# EAGLE design bus (EAGLE 9.6.2)
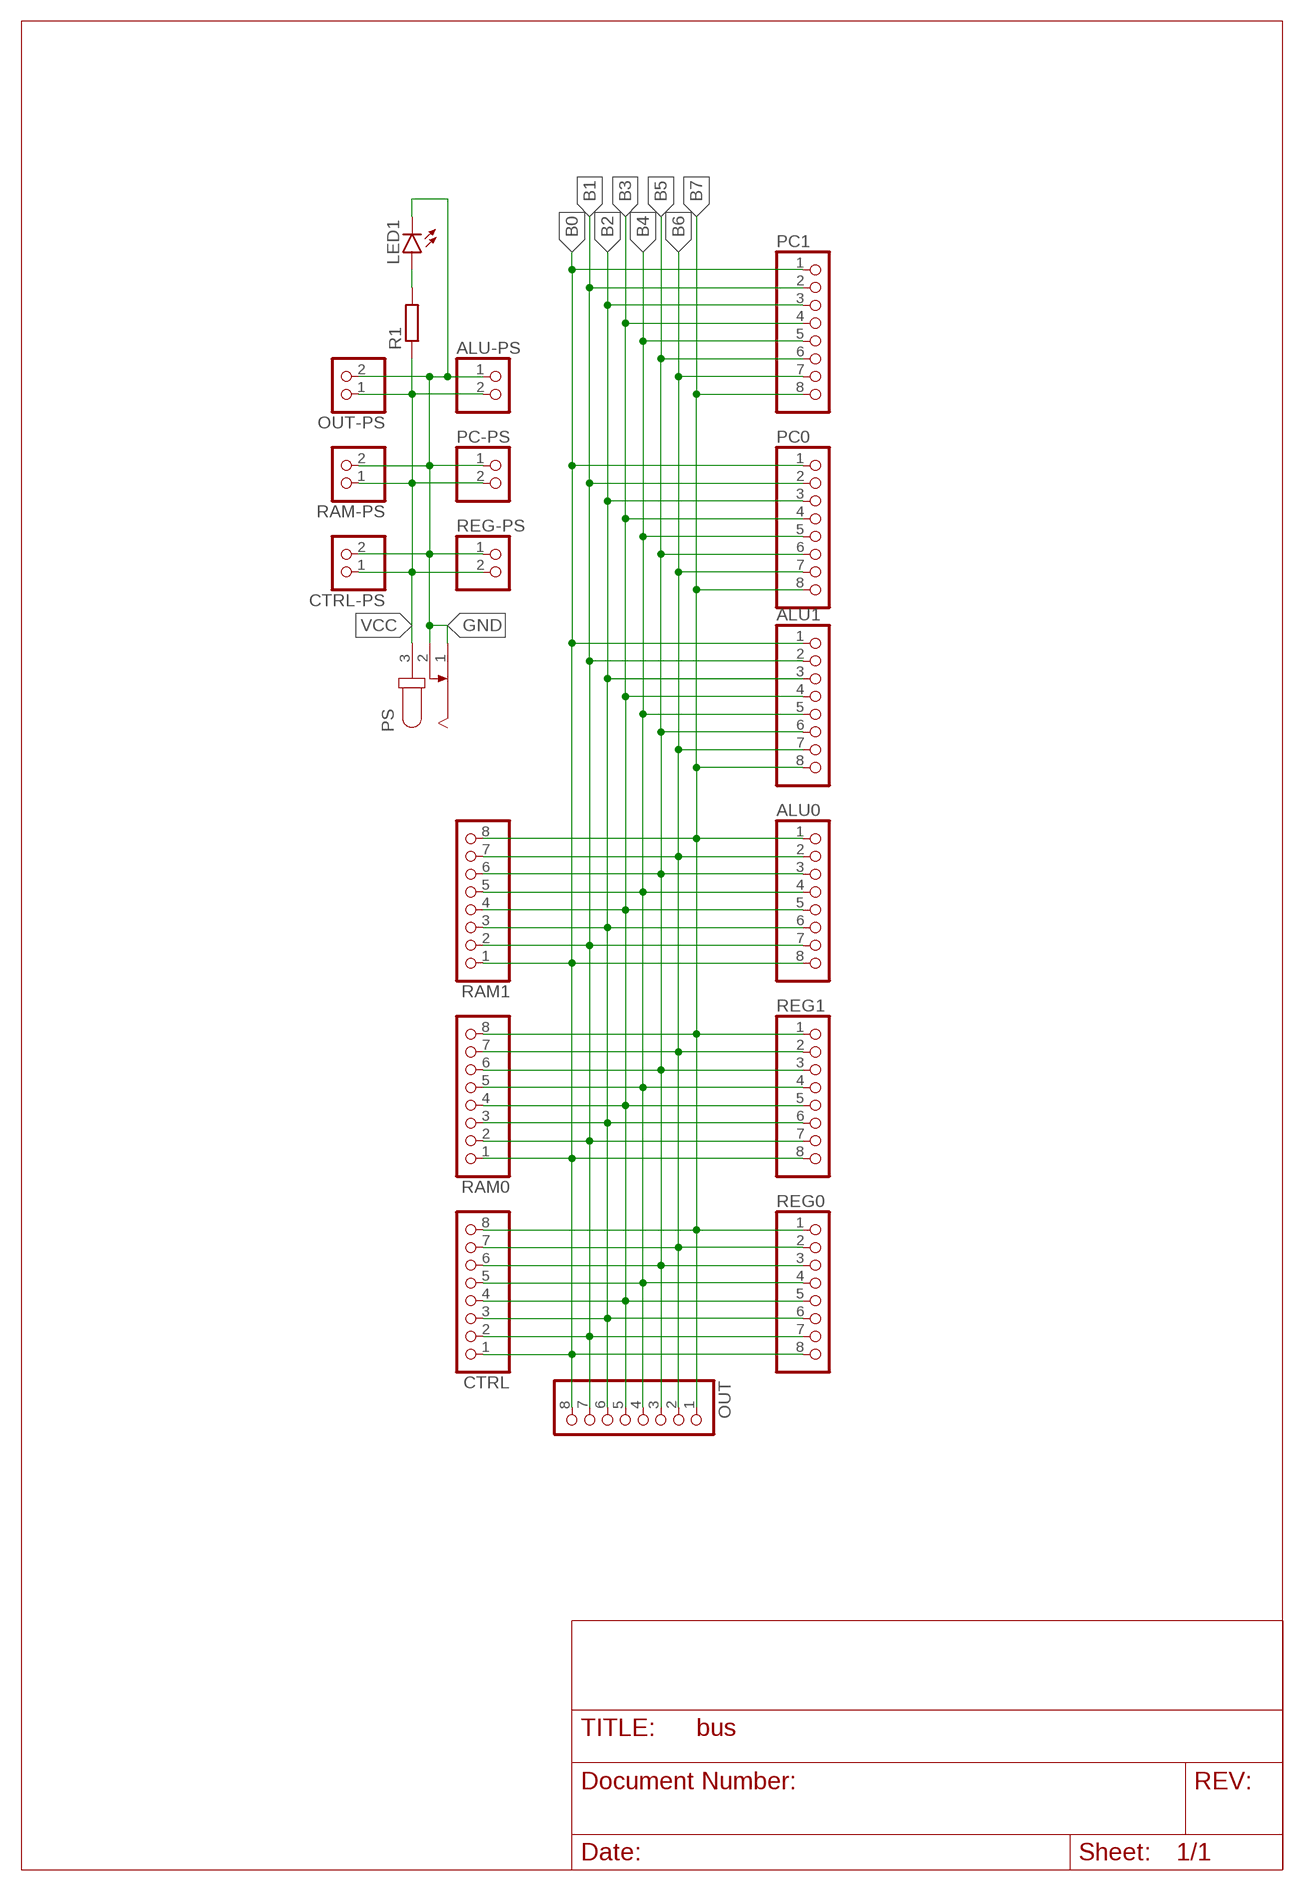
[diagram p0: schematic, sheet 1]

## Parts
ALU0  PINHD-1X8  [1X08]
ALU1  PINHD-1X8  [1X08]
ALU-PS  PINHD-1X2  [1X02]
CTRL  PINHD-1X8  [1X08]
CTRL-PS  PINHD-1X2  [1X02]
LED1  LED5MM  [LED5MM]
OUT  PINHD-1X8  [1X08]
OUT-PS  PINHD-1X2  [1X02]
PC0  PINHD-1X8  [1X08]
PC1  PINHD-1X8  [1X08]
PC-PS  PINHD-1X2  [1X02]
PS  JACK-PLUG0  [SPC4077]
R1  R-EU_0204/7  [0204/7]
RAM0  PINHD-1X8  [1X08]
RAM1  PINHD-1X8  [1X08]
RAM-PS  PINHD-1X2  [1X02]
REG0  PINHD-1X8  [1X08]
REG1  PINHD-1X8  [1X08]
REG-PS  PINHD-1X2  [1X02]

## Nets
B0: ALU0.8 ALU1.1 CTRL.1 OUT.8 PC0.1 PC1.1 RAM0.1 RAM1.1 REG0.8 REG1.8
B1: ALU0.7 ALU1.2 CTRL.2 OUT.7 PC0.2 PC1.2 RAM0.2 RAM1.2 REG0.7 REG1.7
B2: ALU0.6 ALU1.3 CTRL.3 OUT.6 PC0.3 PC1.3 RAM0.3 RAM1.3 REG0.6 REG1.6
B3: ALU0.5 ALU1.4 CTRL.4 OUT.5 PC0.4 PC1.4 RAM0.4 RAM1.4 REG0.5 REG1.5
B4: ALU0.4 ALU1.5 CTRL.5 OUT.4 PC0.5 PC1.5 RAM0.5 RAM1.5 REG0.4 REG1.4
B5: ALU0.3 ALU1.6 CTRL.6 OUT.3 PC0.6 PC1.6 RAM0.6 RAM1.6 REG0.3 REG1.3
B6: ALU0.2 ALU1.7 CTRL.7 OUT.2 PC0.7 PC1.7 RAM0.7 RAM1.7 REG0.2 REG1.2
B7: ALU0.1 ALU1.8 CTRL.8 OUT.1 PC0.8 PC1.8 RAM0.8 RAM1.8 REG0.1 REG1.1
GND: ALU-PS.1 CTRL-PS.2 LED1.K(C) OUT-PS.2 PC-PS.1 PS.1 PS.2 RAM-PS.2 REG-PS.1
N$1: LED1.A R1.2
VCC: ALU-PS.2 CTRL-PS.1 OUT-PS.1 PC-PS.2 PS.3 R1.1 RAM-PS.1 REG-PS.2

## Library data of the parts
ALU0 ALU1 CTRL OUT PC0 PC1 RAM0 RAM1 REG0 REG1 = pinhead:PINHD-1X8: PIN HEADER
ALU-PS CTRL-PS OUT-PS PC-PS RAM-PS REG-PS = pinhead:PINHD-1X2: PIN HEADER
LED1 = led:LED: LED OSRAM: - CHIPLED LG R971, LG N971, LY N971, LG Q971, LY Q971, LO R971, LY R971 LH N974, LH R974 LS Q976, LO Q976, LY Q976 LO Q996 - Hyper CHIPLED LW Q18S LB Q993, LB Q99A, LB R99A - SideLED LS A670, LO A670, LY A670, LG A670, LP A670 LB A673, LV A673, LT A673, LW A673 LH A674 LY A675 LS A676, LA A676, LO A676, LY A676, LW A676 LS A679, LY A679, LG A679 - Hyper Micro SIDELED® LS Y876, LA Y876, LO Y876, LY Y876 LT Y87S - SmartLED LW L88C, LW L88S LB L89C, LB L89S, LG L890 LS L89K, LO L89K, LY L89K LS L896, LA L896, LO L896, LY L896 - TOPLED LS T670, LO T670, LY T670, LG T670, LP T670 LSG T670, LSP T670, LSY T670, LOP T670, LYG T670 LG T671, LOG T671, LSG T671 LB T673, LV T673, LT T673, LW T673 LH T674 LS T676, LA T676, LO T676, LY T676, LB T676, LH T676, LSB T676, LW T676 LB T67C, LV T67C, LT T67C, LS T67K, LO T67K, LY T67K, LW E67C LS E67B, LA E67B, LO E67B, LY E67B, LB E67C, LV E67C, LT E67C LW T67C LS T679, LY T679, LG T679 LS T770, LO T770, LY T770, LG T770, LP T770 LB T773, LV T773, LT T773, LW T773 LH T774 LS E675, LA E675, LY E675, LS T675 LS T776, LA T776, LO T776, LY T776, LB T776 LHGB T686 LT T68C, LB T68C - Hyper Mini TOPLED® LB M676 - Mini TOPLED Santana® LG M470 LS M47K, LO M47K, LY M47K Source: http://www.osram.convergy.de LUXEON: - LUMILED® LXK2-PW12-R00, LXK2-PW12-S00, LXK2-PW14-U00, LXK2-PW14-V00 LXK2-PM12-R00, LXK2-PM12-S00, LXK2-PM14-U00 LXK2-PE12-Q00, LXK2-PE12-R00, LXK2-PE12-S00, LXK2-PE14-T00, LXK2-PE14-U00 LXK2-PB12-K00, LXK2-PB12-L00, LXK2-PB12-M00, LXK2-PB14-N00, LXK2-PB14-P00, LXK2-PB14-Q00 LXK2-PR12-L00, LXK2-PR12-M00, LXK2-PR14-Q00, LXK2-PR14-R00 LXK2-PD12-Q00, LXK2-PD12-R00, LXK2-PD12-S00 LXK2-PH12-R00, LXK2-PH12-S00 LXK2-PL12-P00, LXK2-PL12-Q00, LXK2-PL12-R00 Source: www.luxeon.com KINGBRIGHT: KA-3528ASYC Source: www.kingbright.com
PS = con-jack:JACK-PLUG: DC POWER JACK Power Jack, DC, Right Angle, Through Hole, Rated 5A at 16VDC, PC Terminals Distributor: Farnell (www.Farnell.de) Drawing: 84N1161.pdf / 84N1162.pdf Manufacturer: SPC Technology (www.spctechnology.com) Type: SPC4077 / SPC 4078; OC_FARNELL: unknown; OC_NEWARK: unknown
R1 = rcl:R-EU_: RESISTOR, European symbol; SPICEPREFIX: R

## Board
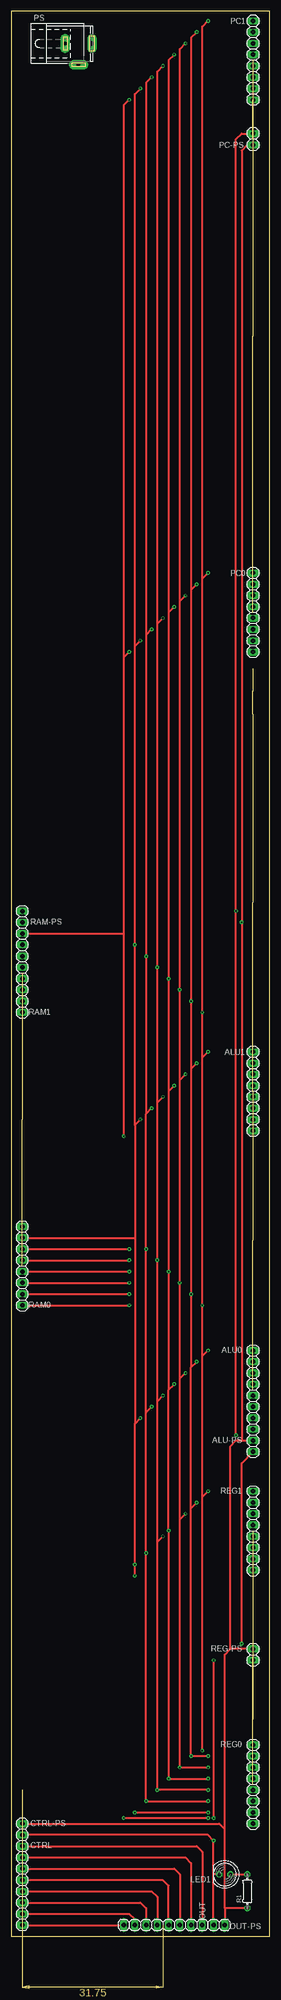
[diagram p1: board, top side]
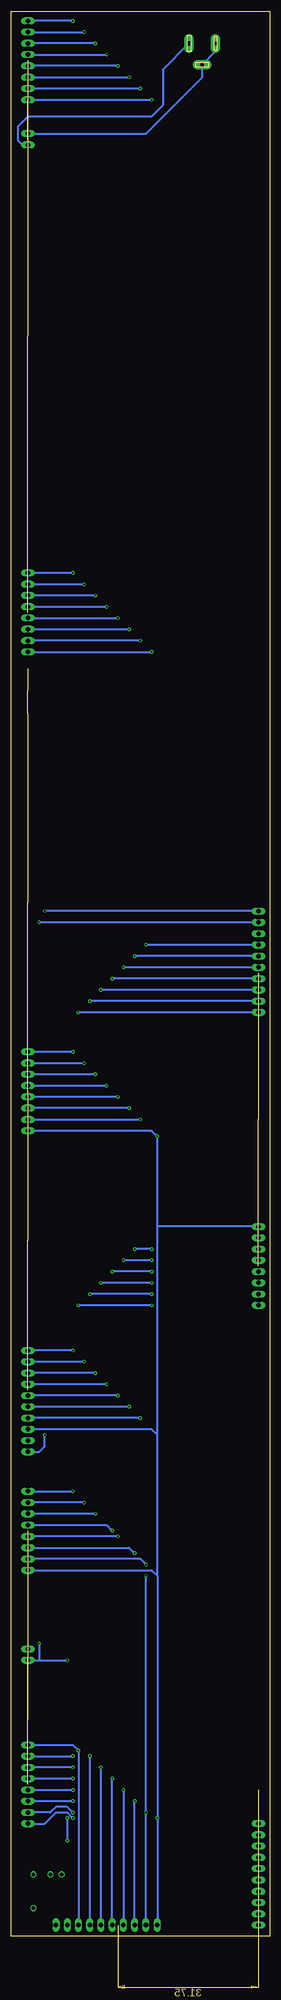
[diagram p2: board, bottom side, seen from below]

Size 58.4 x 434.01 mm. Coordinates in mm from the lower left corner, seen from the top.
Outline: 0,0 58.4,0 58.4,434.01 0,434.01 0,0
Copper layers (1*16): Top 0.035mm / dielectric 1.5mm / Bottom 0.035mm
Design rules "default": minimum track width 6mil, minimum drill 0.35mm, track to track 6mil, track to pad 6mil, pad to pad 6mil, via to via 6mil, smd to smd 6mil, copper to edge 40mil, drill to drill 6mil, minimum pad ring 10mil, minimum via ring 8mil, stop-mask expansion 4mil, vias tented up to drill 0mil, thermal gap 10mil

### Footprints (pad centres in the part's own frame; a part is rotated, then mirrored left to right if it is on the bottom)
1X08 = drill 1.016 long: 1 -8.89,0; 2 -6.35,0; 3 -3.81,0; 4 -1.27,0; 5 1.27,0; 6 3.81,0; 7 6.35,0; 8 8.89,0
1X02 = drill 1.016 long: 1 -1.27,0; 2 1.27,0
LED5MM = drill 0.813 octagon: A -1.27,0; K 1.27,0
SPC4077 = drill 0.8 pad 2.184 long: 1 -3,0; 2 0,-4.8 | drill 1 pad 2.184 long: 3 3,0
0204/7 = drill 0.813 octagon: 1 -3.81,0; 2 3.81,0

### Placement (x,y rotation side)
ALU0  54.61,123.19 90 top
ALU1  54.61,190.5 270 top
ALU-PS  54.61,110.49 90 top
CTRL  2.54,11.43 270 top
CTRL-PS  2.54,24.13 270 top
LED1  48.26,13.97 180 top
OUT  34.29,2.54 0 top
OUT-PS  46.99,2.54 180 top
PC0  54.61,298.45 270 top
PC1  54.61,422.91 270 top
PC-PS  54.61,405.13 270 top
PS  15.24,426.72 0 top
R1  53.34,10.16 90 top
RAM0  2.54,151.13 90 top
RAM1  2.54,217.17 90 top
RAM-PS  2.54,229.87 90 top
REG0  54.61,34.29 90 top
REG1  54.61,91.44 90 top
REG-PS  54.61,63.5 90 top

### Tracks (layer width: path | path; a pad name or v marks a point on that pad's centre or on a via)
B0  (via drill 0.35)
  Top 0.4: CTRL.1 41.91,20.32 43.18,19.05 OUT.8 | v44.45,100.33 43.18,99.06 | v43.18,41.91 43.18,99.06 | 43.18,99.06 43.18,130.81 | v44.45,132.08 43.18,130.81 | 43.18,130.81 v43.18,142.24 43.18,198.12 | v44.45,199.39 43.18,198.12 | 43.18,198.12 v43.18,208.28 43.18,306.07 | v44.45,307.34 43.18,306.07 | 43.18,306.07 43.18,430.53 v44.45,431.8 | RAM0.1 v26.67,142.24
  Bottom 0.4: REG0.8 44.45,43.18 v43.18,41.91 OUT.8 | REG1.8 v44.45,100.33 | v44.45,132.08 ALU0.8 | v44.45,199.39 ALU1.1 | v44.45,307.34 PC0.1 | v44.45,431.8 PC1.1 | v26.67,142.24 v43.18,142.24 | RAM1.1 v43.18,208.28
B1  (via drill 0.35)
  Top 0.4: CTRL.2 39.37,17.78 40.64,16.51 OUT.7 | v44.45,40.64 v40.64,40.64 40.64,96.52 | 40.64,96.52 v41.91,97.79 | 40.64,96.52 40.64,128.27 | 40.64,128.27 v41.91,129.54 | v41.91,196.85 40.64,195.58 | 40.64,195.58 v40.64,144.78 40.64,128.27 | v41.91,304.8 40.64,303.53 | 40.64,303.53 v40.64,210.82 40.64,195.58 | v41.91,429.26 40.64,427.99 40.64,303.53 | RAM0.2 v26.67,144.78
  Bottom 0.4: REG0.7 v44.45,40.64 | v40.64,40.64 OUT.7 | v41.91,97.79 REG1.7 | v41.91,129.54 ALU0.7 | ALU1.2 v41.91,196.85 | PC0.2 v41.91,304.8 | PC1.2 v41.91,429.26 | v26.67,144.78 v40.64,144.78 | RAM1.2 v40.64,210.82
B2  (via drill 0.35)
  Top 0.4: CTRL.3 36.83,15.24 38.1,13.97 OUT.6 | v44.45,38.1 v38.1,38.1 38.1,93.98 | 38.1,93.98 v39.37,95.25 | 38.1,93.98 38.1,125.73 | v39.37,127 38.1,125.73 | 38.1,125.73 v38.1,147.32 38.1,193.04 | 38.1,193.04 v39.37,194.31 | 38.1,193.04 v38.1,213.36 38.1,300.99 | 38.1,300.99 v39.37,302.26 | 38.1,300.99 38.1,425.45 v39.37,426.72 | RAM0.3 v26.67,147.32
  Bottom 0.4: OUT.6 v38.1,38.1 | v44.45,38.1 REG0.6 | v39.37,95.25 REG1.6 | v39.37,127 ALU0.6 | v39.37,194.31 ALU1.3 | v39.37,302.26 PC0.3 | v39.37,426.72 PC1.3 | v26.67,147.32 v38.1,147.32 | RAM1.3 v38.1,213.36
B3  (via drill 0.35)
  Top 0.4: OUT.5 35.56,11.43 34.29,12.7 CTRL.4 | v44.45,35.56 v35.56,35.56 v35.56,91.44 35.56,123.19 | 35.56,123.19 v36.83,124.46 | v36.83,191.77 35.56,190.5 | 35.56,190.5 v35.56,149.86 35.56,123.19 | v36.83,299.72 35.56,298.45 | 35.56,298.45 v35.56,215.9 35.56,190.5 | v36.83,424.18 35.56,422.91 35.56,298.45 | RAM0.4 v26.67,149.86
  Bottom 0.4: OUT.5 v35.56,35.56 | v44.45,35.56 REG0.5 | v35.56,91.44 36.83,92.71 REG1.5 | v36.83,124.46 ALU0.5 | ALU1.4 v36.83,191.77 | PC0.4 v36.83,299.72 | PC1.4 v36.83,424.18 | v26.67,149.86 v35.56,149.86 | RAM1.4 v35.56,215.9
B4  (via drill 0.35)
  Top 0.4: CTRL.5 31.75,10.16 33.02,8.89 OUT.4 | v44.45,33.02 v33.02,33.02 33.02,88.9 | 33.02,88.9 v34.29,90.17 | 33.02,88.9 33.02,120.65 | v34.29,121.92 33.02,120.65 | 33.02,120.65 v33.02,152.4 33.02,187.96 | 33.02,187.96 v34.29,189.23 | 33.02,187.96 v33.02,218.44 33.02,295.91 | 33.02,295.91 v34.29,297.18 | 33.02,295.91 33.02,420.37 v34.29,421.64 | RAM0.5 v26.67,152.4
  Bottom 0.4: REG0.4 v44.45,33.02 | v33.02,33.02 OUT.4 | v34.29,90.17 REG1.4 | v34.29,121.92 ALU0.4 | v34.29,189.23 ALU1.5 | PC0.5 v34.29,297.18 | v34.29,421.64 PC1.5 | v26.67,152.4 v33.02,152.4 | RAM1.5 v33.02,218.44
B5  (via drill 0.35)
  Top 0.4: CTRL.6 29.21,7.62 30.48,6.35 OUT.3 | v44.45,30.48 v30.48,30.48 v30.48,86.36 30.48,118.11 | v31.75,119.38 30.48,118.11 | 30.48,118.11 v30.48,154.94 30.48,185.42 | 30.48,185.42 v31.75,186.69 | v31.75,294.64 30.48,293.37 | 30.48,293.37 v30.48,220.98 30.48,185.42 | v31.75,419.1 30.48,417.83 30.48,293.37 | RAM0.6 v26.67,154.94
  Bottom 0.4: OUT.3 v30.48,30.48 | v44.45,30.48 REG0.3 | REG1.3 31.75,87.63 v30.48,86.36 | v31.75,119.38 ALU0.3 | v31.75,186.69 ALU1.6 | PC0.6 v31.75,294.64 | PC1.6 v31.75,419.1 | v26.67,154.94 v30.48,154.94 | RAM1.6 v30.48,220.98
B6  (via drill 0.35)
  Top 0.4: OUT.2 27.94,3.81 26.67,5.08 CTRL.7 | v27.94,27.94 v44.45,27.94 | v27.94,81.28 v27.94,83.82 27.94,115.57 | 27.94,115.57 v29.21,116.84 | v29.21,184.15 27.94,182.88 | 27.94,182.88 27.94,157.48 | 27.94,157.48 27.94,115.57 | 27.94,182.88 v27.94,223.52 27.94,290.83 | 27.94,290.83 v29.21,292.1 | 27.94,290.83 27.94,415.29 v29.21,416.56 | RAM0.7 27.94,157.48
  Bottom 0.4: OUT.2 v27.94,27.94 v27.94,81.28 | v44.45,27.94 45.72,29.21 48.26,29.21 49.53,27.94 REG0.2 | v27.94,83.82 29.21,85.09 REG1.2 | v29.21,116.84 ALU0.2 | ALU1.7 v29.21,184.15 | v29.21,292.1 PC0.7 | v29.21,416.56 PC1.7 | RAM1.7 v27.94,223.52
B7  (via drill 0.35)
  Top 0.4: CTRL.8 OUT.1 | v44.45,26.67 v25.4,26.67 | v26.67,289.56 25.4,288.29 | 25.4,288.29 25.4,226.06 | 25.4,226.06 v25.4,180.34 | v26.67,414.02 25.4,412.75 25.4,288.29 | RAM1.8 25.4,226.06
  Bottom 0.4: REG0.1 50.8,25.4 48.26,27.94 45.72,27.94 v44.45,26.67 | OUT.1 v25.4,26.67 25.4,81.28 | REG1.1 26.67,82.55 25.4,81.28 | 25.4,81.28 25.4,113.03 | 25.4,113.03 26.67,114.3 ALU0.1 | 25.4,113.03 25.4,160.02 | 25.4,160.02 v25.4,180.34 26.67,181.61 ALU1.8 | PC0.8 v26.67,289.56 | PC1.8 v26.67,414.02 | RAM0.8 25.4,160.02
GND  (via drill 0.35)
  Top 0.4: OUT-PS.2 45.72,13.97 | 45.72,13.97 v45.72,21.59 44.45,22.86 CTRL-PS.2 | v45.72,62.23 v45.72,26.67 | ALU-PS.1 52.07,106.68 v52.07,66.04 | PC-PS.1 52.07,406.4 50.8,405.13 v50.8,231.14 v50.8,113.03 | LED1.K 45.72,13.97
  Bottom 0.4: REG-PS.1 52.07,62.23 | 52.07,62.23 v45.72,62.23 | v45.72,26.67 v45.72,21.59 | v52.07,66.04 52.07,62.23 | ALU-PS.1 52.07,109.22 50.8,110.49 v50.8,113.03 | RAM-PS.2 v50.8,231.14 | PS.1 12.24,424.92 PS.2 15.24,419.1 27.94,406.4 PC-PS.1
N$1
  Top 0.4: LED1.A R1.2
VCC  (via drill 0.35)
  Top 0.4: CTRL-PS.1 46.99,25.4 48.26,24.13 | 48.26,6.35 48.26,24.13 | 48.26,6.35 OUT-PS.1 | 48.26,24.13 48.26,63.5 49.53,64.77 | REG-PS.2 49.53,64.77 | 52.07,111.76 50.8,111.76 49.53,110.49 49.53,64.77 | 52.07,111.76 ALU-PS.2 | PC-PS.2 53.34,403.86 52.07,402.59 v52.07,228.6 52.07,111.76 | R1.1 48.26,6.35
  Bottom 0.4: RAM-PS.1 v52.07,228.6 | PS.3 24.13,420.83 24.13,412.75 26.67,410.21 54.61,410.21 56.9,407.92 56.9,404.88 55.88,403.86 PC-PS.2